# Altium schematic sheet Schematic_Block.SchDoc
size A4; SheetNumber: 1; SheetTotal: 2
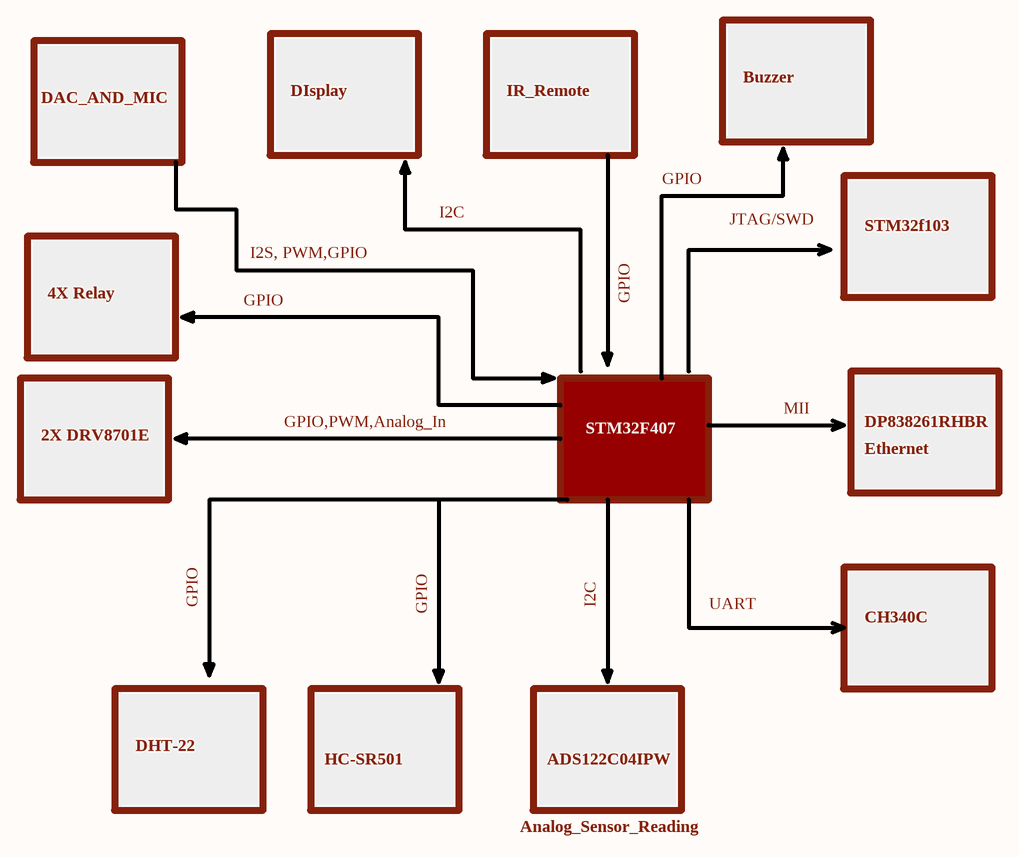
[diagram p0: Schematic_Block.SchDoc]

## Notes on the sheet
- DAC_AND_MIC
- DIsplay
- IR_Remote
- Buzzer
- GPIO
- I2S, PWM,GPIO
- I2C
- JTAG/SWD
- STM32f103
- 4X Relay
- MII
- 2X DRV8701E
- GPIO,PWM,Analog_In
- STM32F407
- DP838261RHBR
- Ethernet
- UART
- CH340C
- DHT-22
- HC-SR501
- ADS122C04IPW
- Analog_Sensor_Reading